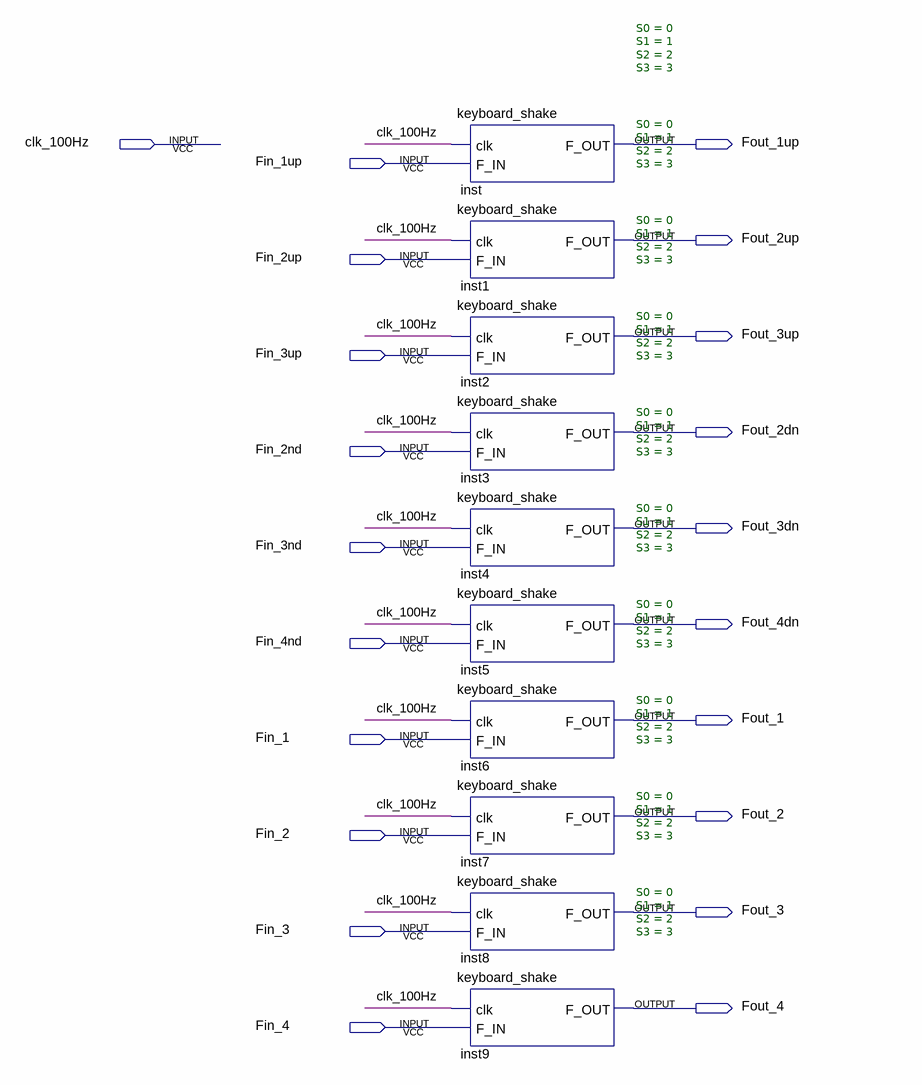
[diagram p0: schematic sheet]
// Quartus schematic shake.bdf as structural Verilog: 10 symbols, 21 pins
module shake (
  input  clk_100Hz,
  input  Fin_1up,
  input  Fin_2up,
  input  Fin_3up,
  input  Fin_2nd,
  input  Fin_3nd,
  input  Fin_4nd,
  input  Fin_1,
  input  Fin_2,
  input  Fin_3,
  input  Fin_4,
  output Fout_1up,
  output Fout_2up,
  output Fout_3up,
  output Fout_2dn,
  output Fout_3dn,
  output Fout_4dn,
  output Fout_1,
  output Fout_2,
  output Fout_3,
  output Fout_4
);

  keyboard_shake #(.S0(0), .S1(1), .S2(2), .S3(3)) inst (.clk(clk_100Hz), .F_IN(Fin_1up), .F_OUT(Fout_1up));
  keyboard_shake #(.S0(0), .S1(1), .S2(2), .S3(3)) inst1 (.clk(clk_100Hz), .F_IN(Fin_2up), .F_OUT(Fout_2up));
  keyboard_shake #(.S0(0), .S1(1), .S2(2), .S3(3)) inst2 (.clk(clk_100Hz), .F_IN(Fin_3up), .F_OUT(Fout_3up));
  keyboard_shake #(.S0(0), .S1(1), .S2(2), .S3(3)) inst3 (.clk(clk_100Hz), .F_IN(Fin_2nd), .F_OUT(Fout_2dn));
  keyboard_shake #(.S0(0), .S1(1), .S2(2), .S3(3)) inst4 (.clk(clk_100Hz), .F_IN(Fin_3nd), .F_OUT(Fout_3dn));
  keyboard_shake #(.S0(0), .S1(1), .S2(2), .S3(3)) inst5 (.clk(clk_100Hz), .F_IN(Fin_4nd), .F_OUT(Fout_4dn));
  keyboard_shake #(.S0(0), .S1(1), .S2(2), .S3(3)) inst6 (.clk(clk_100Hz), .F_IN(Fin_1), .F_OUT(Fout_1));
  keyboard_shake #(.S0(0), .S1(1), .S2(2), .S3(3)) inst7 (.clk(clk_100Hz), .F_IN(Fin_2), .F_OUT(Fout_2));
  keyboard_shake #(.S0(0), .S1(1), .S2(2), .S3(3)) inst8 (.clk(clk_100Hz), .F_IN(Fin_3), .F_OUT(Fout_3));
  keyboard_shake #(.S0(0), .S1(1), .S2(2), .S3(3)) inst9 (.clk(clk_100Hz), .F_IN(Fin_4), .F_OUT(Fout_4));
endmodule
